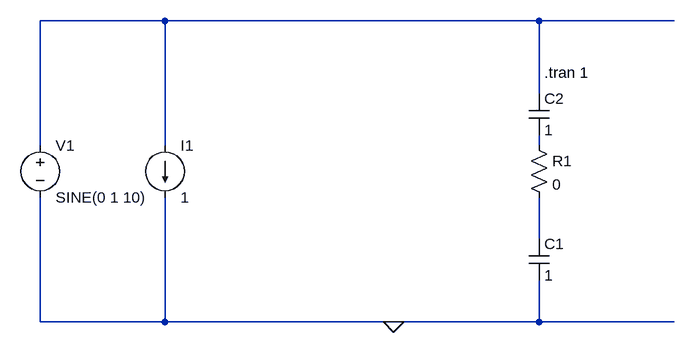
[diagram p0: schematic TRAN_V-Sine_I-DC_C+C.asc]
TRAN_V-Sine_I-DC_C+C.asc, the LTspice schematic file:
Version 4
SHEET 1 880 680
WIRE 64 64 -128 64
WIRE 640 64 64 64
WIRE 848 64 640 64
WIRE 640 176 640 64
WIRE -128 256 -128 64
WIRE 64 256 64 64
WIRE 640 256 640 240
WIRE 640 400 640 336
WIRE -128 528 -128 336
WIRE 64 528 64 336
WIRE 64 528 -128 528
WIRE 416 528 64 528
WIRE 640 528 640 464
WIRE 640 528 416 528
WIRE 848 528 640 528
FLAG 416 528 0
SYMBOL voltage -128 240 R0
SYMATTR InstName V1
SYMATTR Value SINE(0 1 10)
SYMBOL res 624 240 R0
SYMATTR InstName R1
SYMATTR Value 0
SYMBOL current 64 256 R0
SYMATTR InstName I1
SYMATTR Value 1
SYMBOL cap 624 400 R0
SYMATTR InstName C1
SYMATTR Value 1
SYMBOL cap 624 176 R0
SYMATTR InstName C2
SYMATTR Value 1
TEXT 648 144 Left 2 !.tran 1

The netlist it stands for:
* TRAN_V-Sine_I-DC_C+C.asc
V1 N001 0 SINE(0 1 10)
R1 N002 N003 0
I1 N001 0 1
C1 N003 0 1
C2 N001 N002 1
.tran 1
.backanno
.end